# EAGLE design Raspberry Pi Grove Base HAT (EAGLE 6.4)
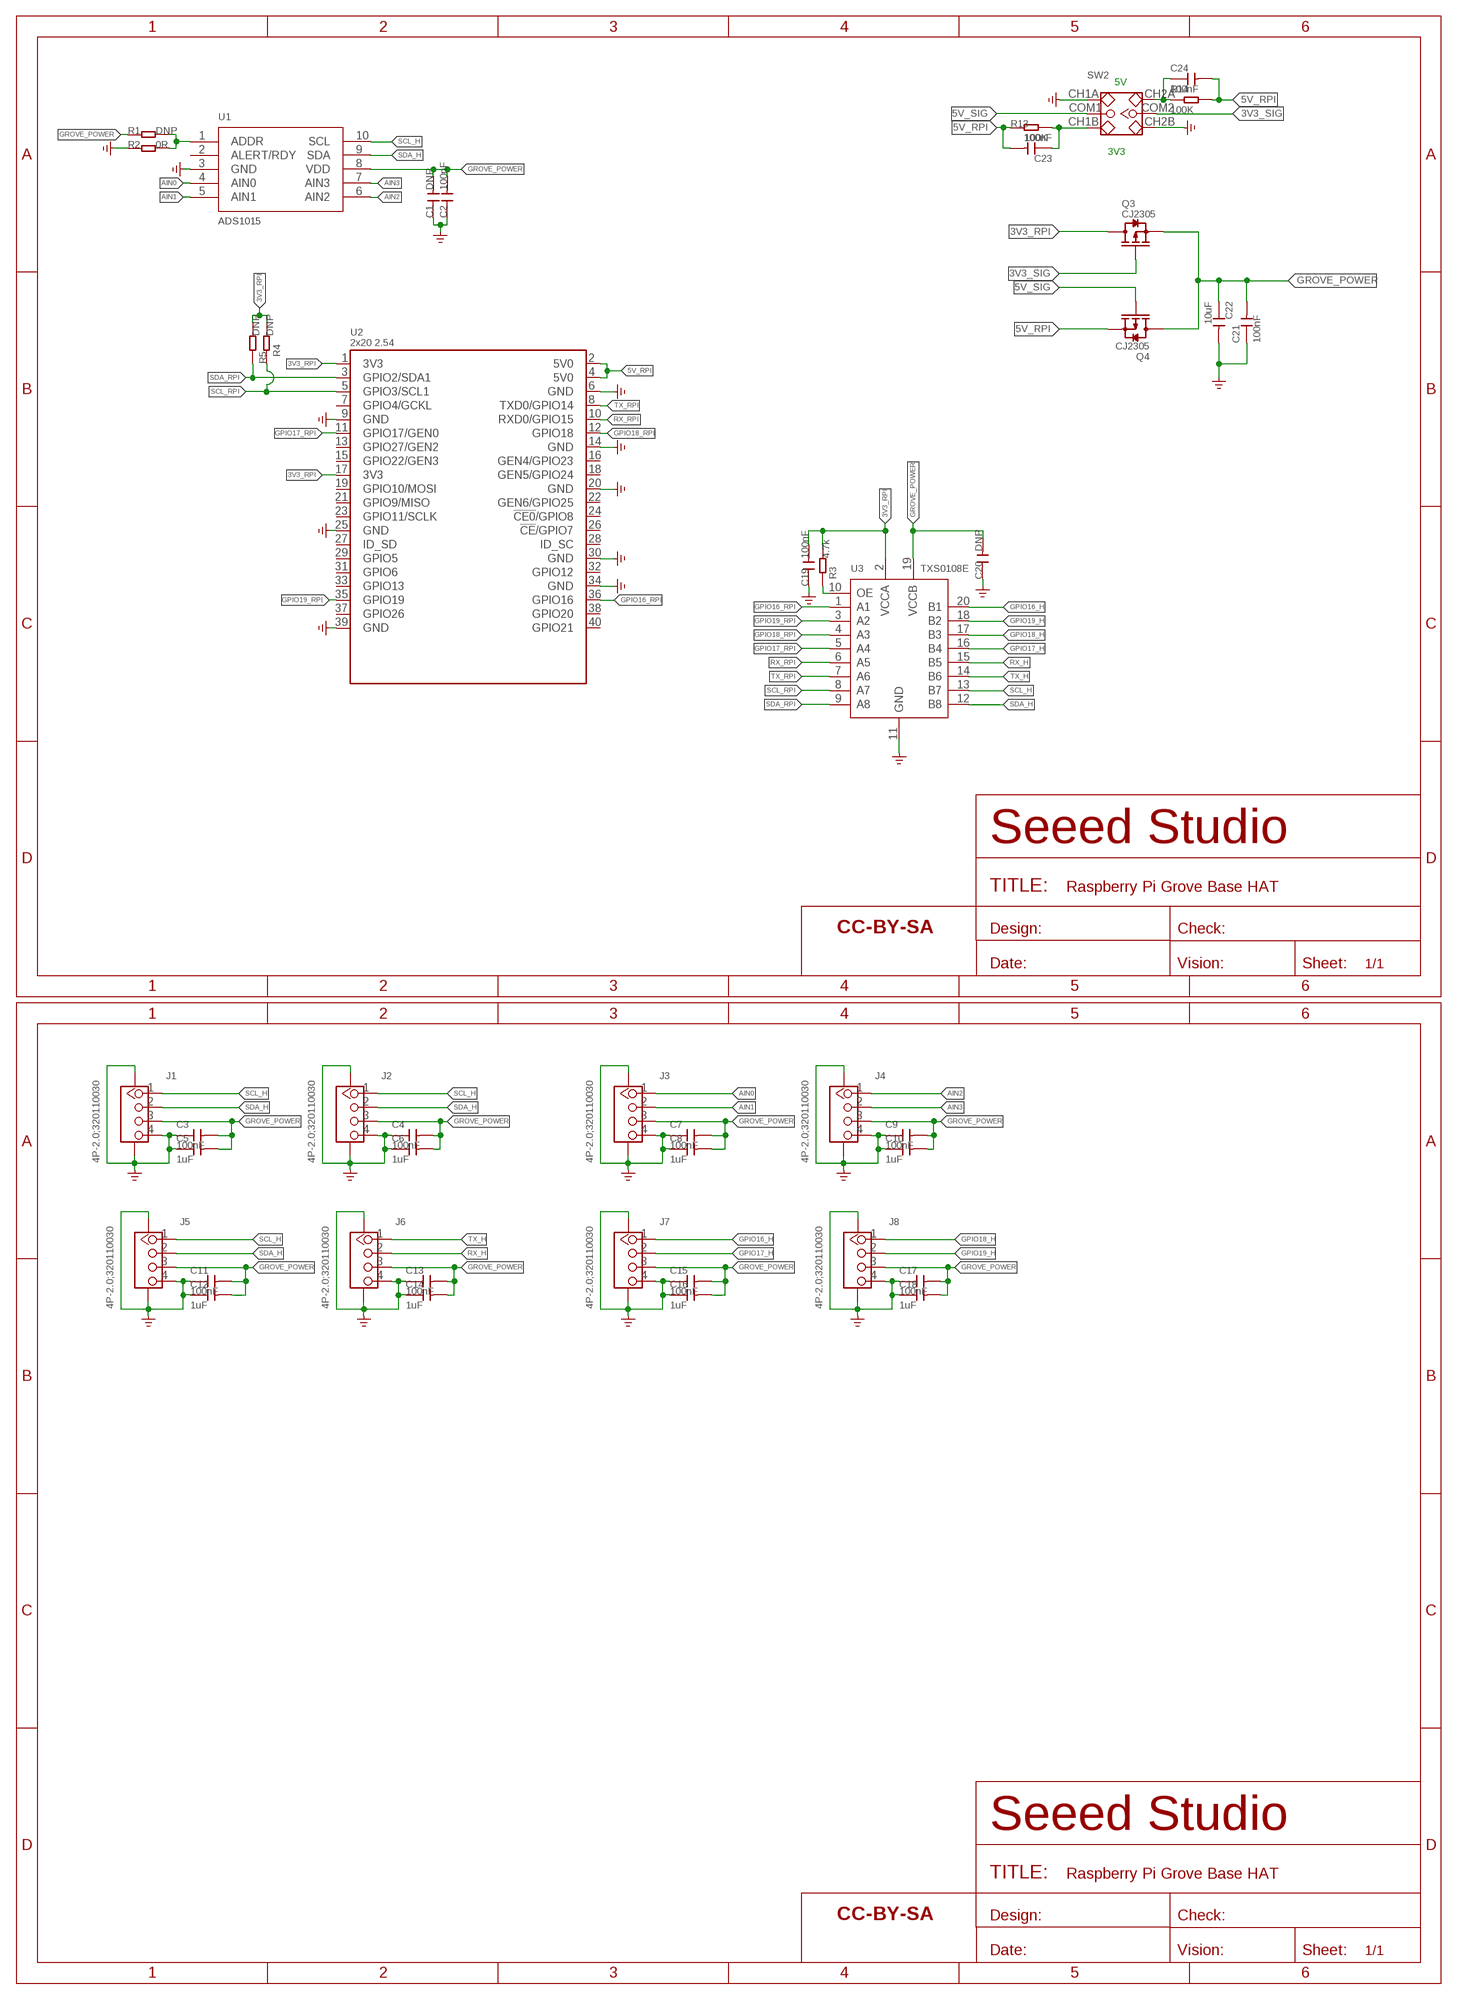
[diagram p0: schematic, sheet 1]

## Parts
C1  DNP  CAP-0603  [C0603]
C2  100nF  CAP-0603  [C0603]
C3  100nF  CAP-0603  [C0603]
C4  100nF  CAP-0603  [C0603]
C5  1uF  CAP-0603  [C0603]
C6  1uF  CAP-0603  [C0603]
C7  100nF  CAP-0603  [C0603]
C8  1uF  CAP-0603  [C0603]
C9  100nF  CAP-0603  [C0603]
C10  1uF  CAP-0603  [C0603]
C11  100nF  CAP-0603  [C0603]
C12  1uF  CAP-0603  [C0603]
C13  100nF  CAP-0603  [C0603]
C14  1uF  CAP-0603  [C0603]
C15  100nF  CAP-0603  [C0603]
C16  1uF  CAP-0603  [C0603]
C17  100nF  CAP-0603  [C0603]
C18  1uF  CAP-0603  [C0603]
C19  100nF  CAP-0603  [C0603]
C20  DNP  CAP-0603  [C0603]
C21  100nF  CAP-0603  [C0603]
C22  10uF  CAP-0603  [C0603]
C23  100nF  CAP-0603  [C0603]
C24  100nF  CAP-0603  [C0603]
FR  SEEEDSTUDIO-OPEN-SCH-FRAME  [SEEEDSTUDIO-PCB-FRAME]
FR1  SEEEDSTUDIO-OPEN-SCH-FRAME  [SEEEDSTUDIO-PCB-FRAME]
J1  4P-2.0;320110030  GROVE-CONNECTOR-SMD'DD'  [HW4-SMD-2.0]
J2  4P-2.0;320110030  GROVE-CONNECTOR-SMD'DD'  [HW4-SMD-2.0]
J3  4P-2.0;320110030  GROVE-CONNECTOR-SMD'DD'  [HW4-SMD-2.0]
J4  4P-2.0;320110030  GROVE-CONNECTOR-SMD'DD'  [HW4-SMD-2.0]
J5  4P-2.0;320110030  GROVE-CONNECTOR-SMD'DD'  [HW4-SMD-2.0]
J6  4P-2.0;320110030  GROVE-CONNECTOR-SMD'DD'  [HW4-SMD-2.0]
J7  4P-2.0;320110030  GROVE-CONNECTOR-SMD'90D'  [HW4-SMD-2.0-90D]
J8  4P-2.0;320110030  GROVE-CONNECTOR-SMD'90D'  [HW4-SMD-2.0-90D]
Q3  CJ2305  MOSFET-P'SI2323CDS/SI2305DS<BR>'  [SOT-23]
Q4  CJ2305  MOSFET-P'SI2323CDS/SI2305DS<BR>'  [SOT-23]
R1  DNP  RES-0603  [R0603]
R2  0R  RES-0603  [R0603]
R3  4.7k  RES-0603  [R0603]
R4  DNP  RES-0603  [R0603]
R5  DNP  RES-0603  [R0603]
R13  100K  RES-0603  [R0603]
R14  100K  RES-0603  [R0603]
SW2  SWITCH-2CH-6P-2.54  SWITCH-2CH-6P-SMD  [6P-SMD-2CH-2.54-3.5X7.2]
U1  ADS1015  CONVERTER-ADS1015IDGST-ADC  [SSOP10-0.5-3X3MM]
U2  2x20 2.54  RPI-ZERO-65X56  [RASPI_BOARD_B+HAT_DF_CF]
U3  TXS0108E  LOGIC-TXS0108EPWR  [TSSOP20-0.65-6.5X4.4MM]

## Nets
3V3_RPI: C19.2 Q3.3(D) R3.2 R4.2 R5.2 U2.1(3V3) U2.17(3V3) U3.2(VCCA)
3V3_SIG: Q3.1(G) SW2.COM2
5V_RPI: C23.2 C24.2 Q4.2(S) R13.1 R14.2 U2.2(5V0) U2.4(5V0)
5V_SIG: Q4.1(G) SW2.COM1
AIN0: J3.1 U1.4(AIN0)
AIN1: J3.2 U1.5(AIN1)
AIN2: J4.1 U1.6(AIN2)
AIN3: J4.2 U1.7(AIN3)
GND: C1.1 C2.1 C3.1 C4.1 C5.1 C6.1 C7.1 C8.1 C9.1 C10.1 C11.1 C12.1 C13.1 C14.1 C15.1 C16.1 C17.1 C18.1 C19.1 C20.1 C21.1 C22.2 J1.4 J1.SS1 J1.SS2 J2.4 J2.SS1 J2.SS2 J3.4 J3.SS1 J3.SS2 J4.4 J4.SS1 J4.SS2 J5.4 J5.SS1 J5.SS2 J6.4 J6.SS1 J6.SS2 J7.4 J7.SS1 J7.SS2 J8.4 J8.SS1 J8.SS2 R2.1 SW2.CH1A SW2.CH2B U1.3(GND) U2.6(GND) U2.9(GND) U2.14(GND) U2.20(GND) U2.25(GND) U2.30(GND) U2.34(GND) U2.39(GND) U3.11(GND) ; supply symbol labelled GND_POWER
GPIO16_H: J7.1 U3.20(B1)
GPIO16_RPI: U2.36(GPIO16) U3.1(A1)
GPIO17_H: J7.2 U3.16(B4)
GPIO17_RPI: U2.11(GPIO17/GEN0) U3.5(A4)
GPIO18_H: J8.1 U3.17(B3)
GPIO18_RPI: U2.12(GPIO18) U3.4(A3)
GPIO19_H: J8.2 U3.18(B2)
GPIO19_RPI: U2.35(GPIO19) U3.3(A2)
GROVE_POWER: C1.2 C2.2 C3.2 C4.2 C5.2 C6.2 C7.2 C8.2 C9.2 C10.2 C11.2 C12.2 C13.2 C14.2 C15.2 C16.2 C17.2 C18.2 C20.2 C21.2 C22.1 J1.3 J2.3 J3.3 J4.3 J5.3 J6.3 J7.3 J8.3 Q3.2(S) Q4.3(D) R1.1 U1.8(VDD) U3.19(VCCB)
N$2: R1.2 R2.2 U1.1(ADDR)
N$5: R3.1 U3.10(OE)
N$11: C23.1 R13.2 SW2.CH1B
N$15: C24.1 R14.1 SW2.CH2A
RX_H: J6.2 U3.15(B5)
RX_RPI: U2.10(RXD0/GPIO15) U3.6(A5)
SCL_H: J1.1 J2.1 J5.1 U1.10(SCL) U3.13(B7)
SCL_RPI: R4.1 U2.5(GPIO3/SCL1) U3.8(A7)
SDA_H: J1.2 J2.2 J5.2 U1.9(SDA) U3.12(B8)
SDA_RPI: R5.1 U2.3(GPIO2/SDA1) U3.9(A8)
TX_H: J6.1 U3.14(B6)
TX_RPI: U2.8(TXD0/GPIO14) U3.7(A6)
Unconnected: U1.2(ALERT/RDY) U2.7(GPIO4/GCKL) U2.13(GPIO27/GEN2) U2.15(GPIO22/GEN3) U2.16(GEN4/GPIO23) U2.18(GEN5/GPIO24) U2.19(GPIO10/MOSI) U2.21(GPIO9/MISO) U2.22(GEN6/GPIO25) U2.23(GPIO11/SCLK) U2.24(!CE0!/GPIO8) U2.26(!CE!/GPIO7) U2.27(ID_SD) U2.28(ID_SC) U2.29(GPIO5) U2.31(GPIO6) U2.32(GPIO12) U2.33(GPIO13) U2.37(GPIO26) U2.38(GPIO20) U2.40(GPIO21)

## Notes on the sheet
- 5V
- 3V3

## Library data of the parts
C1-C24 = Discrete-new:CAP: Ceramic Capacitors
FR FR1 = moudle-new:SEEEDSTUDIO-OPEN-SCH-FRAME
J1-J8 = Connector-new:GROVE-CONNECTOR-SMD: 4P-SMD-2.0:320110030;4P-SMD-2.0-90D:320110032
Q3 Q4 = Discrete-new:MOSFET-P
R1-R5 R13 R14 = Discrete-new:RES
SW2 = Discrete:SWITCH-2CH-6P
U1 = IC-new:CONVERTER-ADS1015IDGST-ADC; MPN: ADS1015IDGST-ADC-兼容1.8V-3.3V
U2 = IC-new:RPI-ZERO
U3 = IC-new:LOGIC-TXS0108EPWR: 310050026

## Net classes
0 default: width 0.025 mm, clearance 0.152 mm

## Board
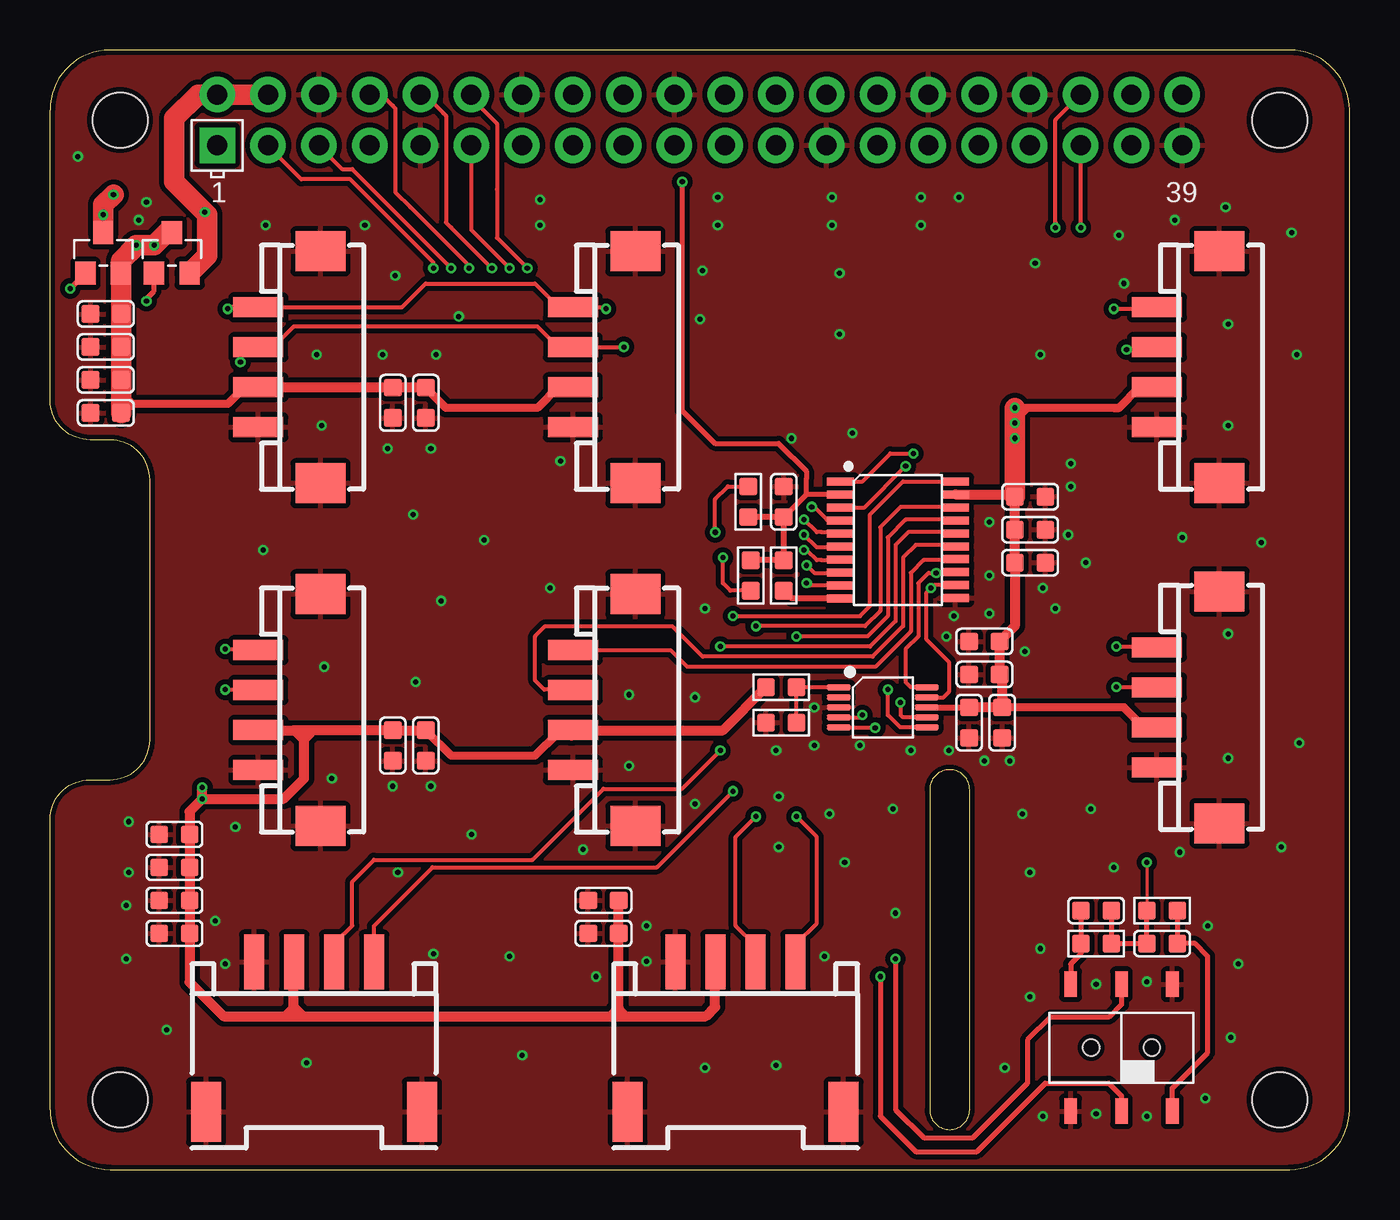
[diagram p1: board, top side]
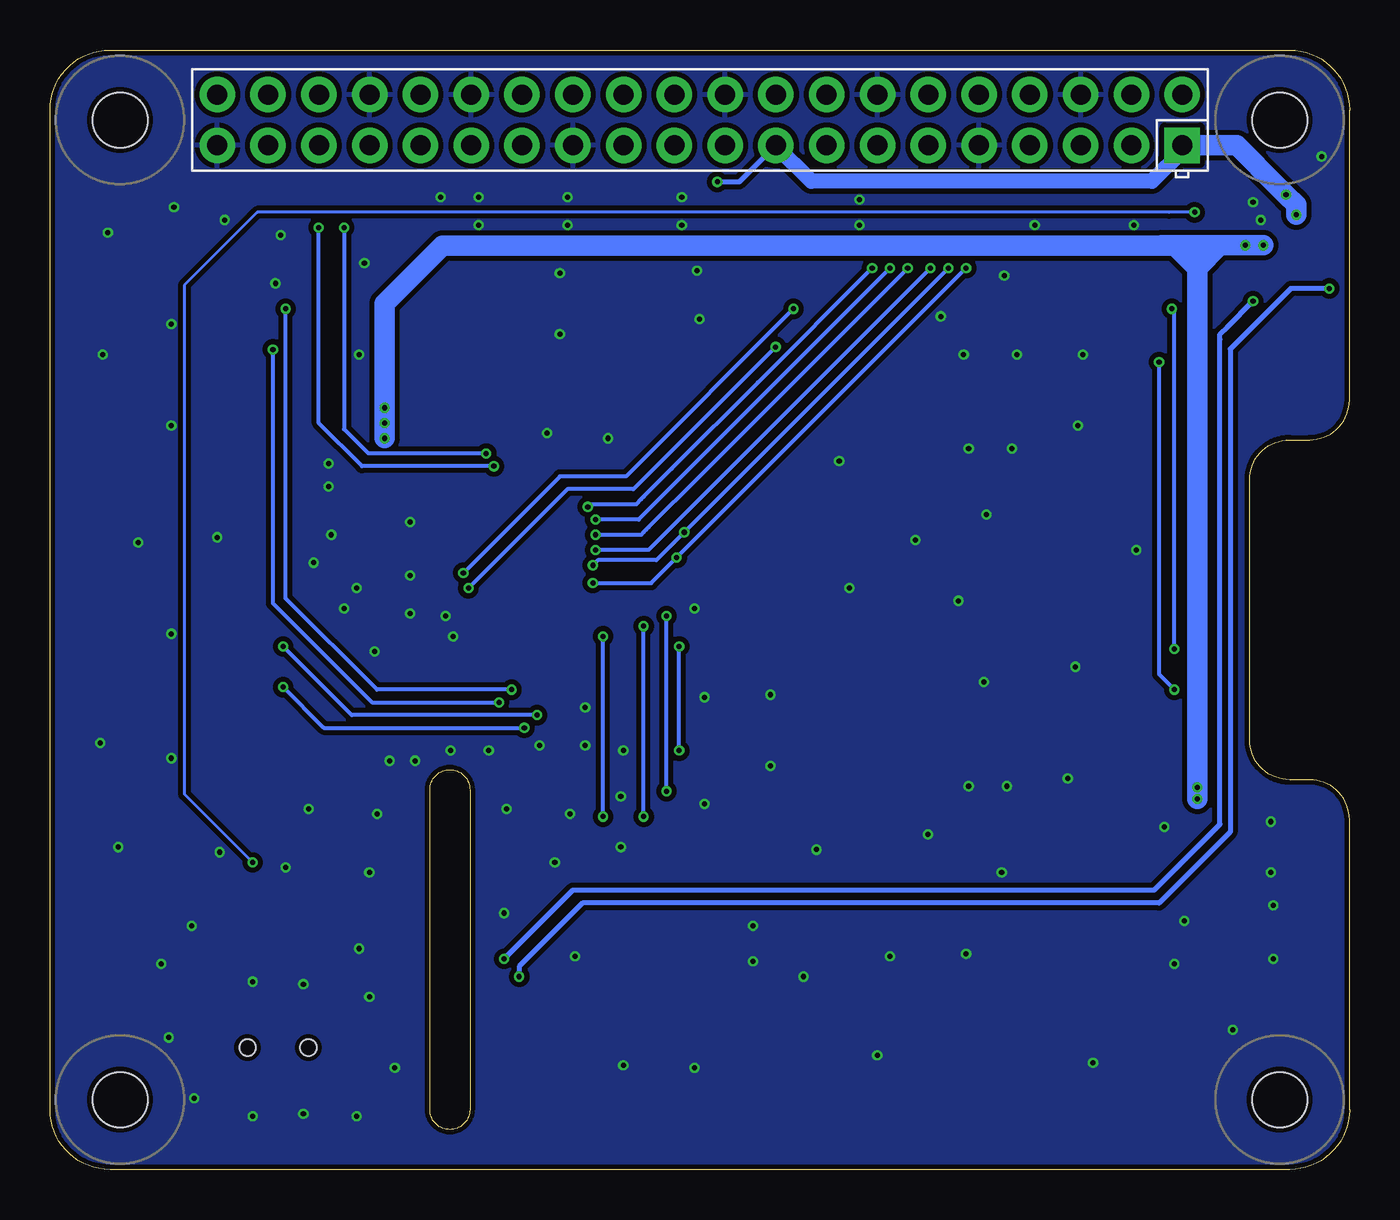
[diagram p2: board, bottom side, seen from below]

Size 65 x 56 mm. Coordinates in mm from the lower left corner, seen from the top.
Copper layers (1*16): Top 0.035mm / dielectric 1.5mm / Bottom 0.035mm
Design rules "SeeedStudio_2layer_DRU_no_angle_20140221 *": minimum track width 1mil, minimum drill 10mil, track to track 6mil, track to pad 6mil, pad to pad 6mil, via to via 6mil, smd to smd 0mil, copper to edge 10mil, drill to drill 10mil, minimum pad ring 4mil, minimum via ring 4mil, stop-mask expansion 2mil, vias tented up to drill 25mil, thermal gap 10mil

### Footprints (pad centres in the part's own frame; a part is rotated, then mirrored left to right if it is on the bottom)
C0603 = smd 0.889 x 0.889: 1 0,0.762; 2 0,-0.762
HW4-SMD-2.0 = smd 1 x 2.5: 1 -3,0; 2 -1,0; 3 1,0; 4 3,0 | smd 2 x 2.5: SS1 -5.8,3.123; SS2 5.8,3.123
HW4-SMD-2.0-90D = smd 1.01 x 2.74: 1 -3,-0.1; 2 -1,-0.1; 3 1,-0.1; 4 3,-0.1 | smd 1.5 x 3: SS1 -5.4,7.4; SS2 5.4,7.4
SOT-23 = smd 1.143 x 1.016: 1 1.016,-0.889; 2 1.016,0.889; 3 -1.016,0
R0603 = smd 0.889 x 0.889: 1 0,0.762; 2 0,-0.762
6P-SMD-2CH-2.54-3.5X7.2 = smd 1.27 x 0.635: CH1A -3.175,2.54; CH1B -3.175,-2.54; CH2A 3.175,2.54; CH2B 3.175,-2.54; COM1 -3.175,0; COM2 3.175,0 | hole 0.813: 0,1.524; 0,-1.524
SSOP10-0.5-3X3MM = smd 0.3 x 1.2: 1 -1,-2.2; 2 -0.5,-2.2; 3 0,-2.2; 4 0.5,-2.2; 5 1,-2.2; 6 1,2.2; 7 0.5,2.2; 8 0,2.2; 9 -0.5,2.2; 10 -1,2.2
RASPI_BOARD_B+HAT_DF_CF = drill 1 pad 1.778 square: 1 8.37,51.23 | drill 1 pad 1.778: 2 8.37,53.77; 3 10.91,51.23; 4 10.91,53.77; 5 13.45,51.23; 6 13.45,53.77; 7 15.99,51.23; 8 15.99,53.77; 9 18.53,51.23; 10 18.53,53.77; 11 21.07,51.23; 12 21.07,53.77; 13 23.61,51.23; 14 23.61,53.77; 15 26.15,51.23; 16 26.15,53.77; 17 28.69,51.23; 18 28.69,53.77; 19 31.23,51.23; 20 31.23,53.77; 21 33.77,51.23; 22 33.77,53.77; 23 36.31,51.23; 24 36.31,53.77; 25 38.85,51.23; 26 38.85,53.77; 27 41.39,51.23; 28 41.39,53.77; 29 43.93,51.23; 30 43.93,53.77; 31 46.47,51.23; 32 46.47,53.77; 33 49.01,51.23; 34 49.01,53.77; 35 51.55,51.23; 36 51.55,53.77; 37 54.09,51.23; 38 54.09,53.77; 39 56.63,51.23; 40 56.63,53.77 | hole 2.75: 3.5,3.5; 3.5,52.5; 61.5,3.5; 61.5,52.5
TSSOP20-0.65-6.5X4.4MM = smd 0.4 x 1.35: 1 -2.925,-2.875; 2 -2.275,-2.875; 3 -1.625,-2.875; 4 -0.975,-2.875; 5 -0.325,-2.875; 6 0.325,-2.875; 7 0.975,-2.875; 8 1.625,-2.875; 9 2.275,-2.875; 10 2.925,-2.875; 11 2.91,2.875; 12 2.26,2.875; 13 1.61,2.875; 14 0.96,2.875; 15 0.325,2.875; 16 -0.325,2.875; 17 -0.975,2.875; 18 -1.625,2.875; 19 -2.275,2.875; 20 -2.925,2.875

### Placement (x,y rotation side)
C1  47.63,22.35 180 top
C2  45.97,22.35 180 top
C3  2.79,37.85 90 top
C4  18.8,38.35 180 top
C5  2.79,39.5 90 top
C6  17.15,38.35 180 top
C7  46.74,24.77 90 top
C8  46.74,26.42 90 top
C9  49.02,32 270 top
C10  49.02,33.66 270 top
C11  6.22,15.11 90 top
C12  6.22,16.76 90 top
C13  18.8,21.21 180 top
C14  17.15,21.21 180 top
C15  6.22,11.81 90 top
C16  6.22,13.46 90 top
C17  27.69,11.81 90 top
C18  27.69,13.46 90 top
C19  36.7,33.4 0 top
C20  49.02,30.35 270 top
C21  2.79,41.15 90 top
C22  2.79,42.8 270 top
C23  52.32,12.95 90 top
C24  55.63,11.3 270 top
FR  -8,-20.57 0 top  (outside the outline)
FR1  -0.51,-57.53 0 top  (outside the outline)
J1  10.41,40.13 270 top
J2  26.16,40.13 270 top
J3  55.37,23.11 270 top
J4  55.37,40.13 270 top
J5  10.41,22.99 270 top
J6  26.16,22.99 270 top
J7  13.21,10.29 180 top
J8  34.29,10.29 180 top
Q3  2.67,45.85 270 top
Q4  6.1,45.85 270 top
R1  36.58,24.13 90 top
R2  36.58,22.35 90 top
R3  36.7,29.72 180 top
R4  34.93,33.4 0 top
R5  35.05,29.72 180 top
R13  52.32,11.3 270 top
R14  55.63,12.95 270 top
SW2  53.59,6.1 270 top
U1  41.66,23.11 270 top
U2  0,0 0 top
U3  42.42,31.5 270 top

### Tracks (layer width: path | path; a pad name or v marks a point on that pad's centre or on a via)
3V3_RPI  (via drill 0.25 pad 0.51)
  Top 0.254: U3.2 37.84,33.77 | 37.84,33.77 C19.2 | 37.84,33.77 37.84,34.54 37.84,34.94 36.45,36.32 33.27,36.32 31.62,37.97 31.62,48.64 v31.62,49.4
  Top 0.305: R5.2 R3.2 C19.2 R4.2
  Top 1.016: v3.18,48.77 2.67,48.26 v2.67,47.75 Q3.3
  Bottom 0.254: U2.17 30.52,49.4 v31.62,49.4
  Bottom 0.762: U2.1 8.37,50.94 9.88,49.43 26.92,49.43 28.7,51.22 U2.17
  Bottom 1.016: U2.1 5.64,51.23 3.56,49.15 v3.18,48.77 2.67,48.26 v2.67,47.75
3V3_SIG  (via drill 0.25 pad 0.51)
  Top 0.254: Q3.1 v1.02,44.07 | v41.53,9.65 41.53,2.67 43.31,0.89 46.36,0.89 49.78,4.32 52.96,4.32 53.59,3.68 SW2.COM2
  Bottom 0.254: v1.02,44.07 2.94,44.07 5.97,41.04 5.97,16.87 5.99,16.87 9.53,13.34 38.35,13.34 41.53,10.16 v41.53,9.65
5V_RPI  (via drill 0.25 pad 0.51)
  Top 0.152: v54.86,15.37 R14.2
  Top 0.254: C23.2 R13.1 C24.2 R14.2
  Top 1.016: U2.4 U2.2 7.42,53.77 6.22,52.58 6.22,49.4 v7.75,47.88 7.87,47.75 7.87,45.72 Q4.2
  Bottom 0.152: v7.75,47.88 9.02,47.88 54.63,47.88 58.28,44.23 58.28,18.78 v54.86,15.37
5V_SIG  (via drill 0.25 pad 0.51)
  Top 0.254: SW2.COM1 53.59,8.26 52.96,7.62 50.04,7.62 48.9,6.48 48.9,4.32 46.17,1.59 43.7,1.59 42.29,3 v42.29,10.54 | v4.83,43.43 4.83,43.56 5.21,43.94 Q4.1
  Bottom 0.254: v42.29,10.54 38.86,13.97 9.78,13.97 6.48,17.27 6.48,41.53 6.48,41.78 6.1,42.16 v4.83,43.43
AIN0  (via drill 0.25 pad 0.51)
  Top 0.203: U1.4 40.52,22.61 v40.64,22.73 | v53.34,26.16 55.32,26.16 J3.1
  Bottom 0.203: v40.64,22.73 49.91,22.73 v53.34,26.16
AIN1  (via drill 0.25 pad 0.51)
  Top 0.203: U1.5 41.26,22.11 v41.28,22.1 | 55.23,24.26 J3.2 55.36,24.13 v53.34,24.13
  Bottom 0.203: v53.34,24.13 51.31,22.1 v41.28,22.1
AIN2  (via drill 0.25 pad 0.51)
  Top 0.203: U1.6 42.53,22.11 41.91,22.73 v41.91,24 | v53.21,43.05 55.29,43.05 J4.1
  Bottom 0.203: v53.21,43.05 53.21,28.57 48.64,24 v41.91,24
AIN3  (via drill 0.25 pad 0.51)
  Top 0.203: U1.7 42.66,22.61 42.55,22.73 v42.55,23.37 | 55.36,41.15 J4.2 55.26,41.02 v53.85,41.02
  Bottom 0.203: v53.85,41.02 53.85,28.32 48.9,23.37 v42.55,23.37
GND  (via drill 0.25 pad 0.51)
  other vias: 12.83,5.33 23.62,5.72 32.77,5.08 36.32,5.21 19.18,10.8 22.99,10.67 44.96,20.95 46.74,20.45 48.01,20.45 44.83,26.67 45.21,27.69 46.99,27.81 46.99,29.72 46.99,32.39 48.77,25.91 50.29,28.07 49.66,29.08 51.82,30.35 50.93,31.75 51.05,34.16 51.05,35.31 49.53,40.77 53.47,46.74 53.72,44.32 49.28,45.34 58.8,48.13 56.26,47.5 62.1,46.86 62.36,40.77 58.93,42.29 58.93,37.21 56.64,31.62 60.58,31.37 58.93,26.8 58.93,20.57 62.48,21.34 53.21,15.11 49.02,14.86 49.53,11.05 56.52,15.88 61.6,16.13 57.91,12.19 54.86,9.4 52.32,9.27 59.44,10.29 59.06,6.6 57.79,3.56 54.86,2.67 52.32,2.79 49.66,2.67 47.75,5.08 49.02,8.64 48.64,17.78 52.07,18.03 38.23,23.11 38.23,21.21 40.51,21.21 43.05,20.95 36.32,20.95 36.45,18.67 36.45,16.13 38.99,17.78 42.16,18.03 39.75,15.37 42.29,12.83 38.74,10.67 29.85,12.19 29.85,10.41 27.31,9.65 8.26,12.45 8.76,10.29 9.27,17.15 17.15,19.18 19.05,19.18 14.1,19.56 21.08,16.76 32.26,18.29 26.67,16 28.96,20.19 32.26,23.62 28.96,23.75 32.77,28.07 25.02,29.08 25.53,35.43 16.89,36.07 37.08,36.58 13.59,37.21 10.67,30.99 18.16,32.77 13.72,25.15 18.29,24.38 21.72,31.5 17.27,44.7 32.51,42.55 39.5,41.78 3.94,17.4 3.94,14.86 3.81,13.21 3.81,10.54 5.84,6.98 19.05,36.07 19.56,28.45 13.34,40.77 19.3,40.77 40.13,36.83 39.5,44.83 32.64,44.96 45.47,48.64 39.12,47.24 43.56,47.24 33.4,47.24 24.51,47.24 10.8,47.24 15.75,47.24 4.83,48.39 1.4,50.67 43.56,48.64 39.12,48.64 33.4,48.64 24.51,48.51 4.45,47.5 17.4,14.86 20.45,42.67 16.64,40.77
  pour Top (isolate 0.254, rank 6): -0.63,56.39 65.41,56.39 65.41,-0.25 -0.63,-0.25
  pour Bottom (isolate 0.254, rank 6): -1.02,56.64 65.66,56.64 65.66,-0.51 -1.02,-0.51
GPIO16_H  (via drill 0.25 pad 0.51)
  Top 0.203: J7.1 16.21,12.19 19.13,15.11 30.35,15.11 v34.16,18.92 | U3.20 42.67,34.42 41.02,32.77 41.02,28.19 40.51,27.69 v34.16,27.69
  Bottom 0.203: v34.16,18.92 v34.16,27.69
GPIO16_RPI  (via drill 0.25 pad 0.51)
  Top 0.203: U2.36 50.29,52.51 50.29,47.37 v50.29,47.12 | U3.1 40.64,34.42 42.04,35.81 v43.18,35.81
  Bottom 0.203: v43.18,35.81 49.07,35.81 50.06,36.81 50.29,37.04 v50.29,47.12
GPIO17_H  (via drill 0.25 pad 0.51)
  Top 0.203: J7.2 14.32,10.39 14.32,11.4 15.11,12.19 15.11,14.4 16.21,15.49 24.13,15.49 27.69,19.05 31.62,19.05 v33.53,20.95 | U3.16 45.24,31.88 42.93,31.88 42.29,31.24 42.29,27.43 41.02,26.16 v33.53,26.16
  Bottom 0.203: v33.53,20.95 v33.53,26.16
GPIO17_RPI  (via drill 0.25 pad 0.51)
  Top 0.203: U2.11 21.07,49.16 21.07,47 v22.99,45.09 | U3.5 39.49,31.88 38.61,31.88 38.35,31.88 v37.72,32.51
  Bottom 0.203: v22.99,45.09 29.08,38.99 33.78,34.29 35.05,33.02 35.31,32.77 35.43,32.64 35.56,32.51 v37.72,32.51
GPIO18_H  (via drill 0.25 pad 0.51)
  Top 0.203: U3.17 45.25,32.51 42.8,32.51 41.91,31.62 41.91,27.69 40.89,26.67 v37.34,26.67 | J8.1 37.34,10.44 37.34,11.3 38.35,12.32 38.35,16.64 v37.34,17.65
  Bottom 0.203: v37.34,17.65 v37.34,26.67
GPIO18_RPI  (via drill 0.25 pad 0.51)
  Top 0.203: U2.12 21.07,53.61 22.35,52.32 22.35,49.02 22.35,46.61 v23.88,45.09 | v38.1,33.15 38.23,33.15 38.86,32.51 39.5,32.51 U3.4
  Bottom 0.203: v23.88,45.09 29.59,39.37 33.91,35.05 35.31,33.66 35.43,33.53 35.69,33.27 37.97,33.27 v38.1,33.15
GPIO19_H  (via drill 0.25 pad 0.51)
  Top 0.203: U3.18 45.27,33.15 42.55,33.15 41.53,32.13 41.53,27.94 40.77,27.18 v35.31,27.18 | J8.2 35.31,10.4 35.31,11.18 34.29,12.19 34.29,16.64 v35.31,17.65
  Bottom 0.203: v35.31,17.65 v35.31,27.18
GPIO19_RPI  (via drill 0.25 pad 0.51)
  Top 0.203: U3.3 40.74,33.12 v42.8,35.18 | v51.56,47.12 51.55,47.13 U2.35
  Bottom 0.203: v42.8,35.18 49.4,35.18 51.56,37.34 v51.56,47.12
GROVE_POWER  (via drill 0.25 pad 0.51)
  Top 0.203: 10.3,39.37 10.3,39.26 10.29,39.24 10.41,39.24 10.54,39.12 | 26.18,21.97 J6.3 26.16,21.72 | 3.56,38.73 3.81,38.73 4.19,38.35 4.19,38.23 3.94,37.97 | 48.26,37.72 48.64,37.72 49.02,38.1
  Top 0.254: U1.8 43.94,23.11 | 26.04,21.72 26.16,21.72 26.8,21.72
  Top 0.305: 43.94,23.11 C2.2
  Top 0.406: 12.19,21.97 12.57,21.59 12.83,21.59 13.08,21.84 | 9.78,38.99 9.59,38.99 8.89,38.29 3.62,38.29 | C13.2 20.07,20.7 24.26,20.7 25.4,21.84 26.02,21.84 J6.3 | 47.75,23.49 47.63,23.62 | J2.3 25.42,39.13 24.38,38.1 19.81,38.1 C4.2 | J3.3 54.72,22.11 53.72,23.11 C1.2 | v48.26,38.1 49.02,38.1 53.2,38.1 53.34,38.1 53.47,38.1 54.5,39.13 J4.3
  Top 0.508: J5.3 10.43,21.97 12.19,21.97 12.7,21.97 | 26.04,21.72 26.15,21.72 | C13.2 C14.2 12.7,21.97 | 11.76,7.66 12.19,8.1 12.19,8.13 | 12.19,8.13 12.19,10.37 J7.3 | 12.66,7.66 28.03,7.66 | 28.03,7.66 28.45,8.09 C17.2 C18.2 | 11.76,7.66 12.66,7.66 | 12.66,7.66 12.19,8.13 | 28.03,7.66 28.79,7.66 | 28.79,7.66 32.81,7.66 33.27,8.13 33.27,10.37 J8.3 | 28.79,7.66 28.45,8 | v7.62,18.54 6.99,17.91 C12.2 C11.2 C16.2 C15.2 6.99,9.37 8.69,7.66 11.76,7.66 | v7.62,18.54 v7.62,19.11 | C10.2 48.26,33.78 | U3.19 48.14,33.77 C10.2 | C10.2 C9.2 C20.2 48.26,27.18 C8.2 C7.2 47.63,24.64 47.63,23.62 C1.2 C2.2 | 11.76,7.66 | C4.2 C6.2 10.54,39.12 9.91,39.12 9.78,38.99 10.27,38.99 J1.3 | 26.18,21.97 33.66,21.97 R1.1 | v7.62,18.54 11.68,18.54 12.7,19.56 12.7,21.97
  Top 1.016: v48.26,38.1 48.26,37.72 v48.26,36.58 C10.2 | Q4.3 5.84,46.86 v5.21,46.23 v4.32,46.23 3.94,45.85 3.56,45.47 Q3.2 C22.1 C21.2 C5.2 3.56,38.73 C3.2 3.56,38.23 3.62,38.29
  Bottom 1.016: v48.26,36.58 v48.26,37.34 v48.26,38.1 48.26,43.31 45.35,46.22 8.75,46.22 8.64,46.1 7.81,45.28 7.62,45.09 | v7.62,18.54 v7.62,19.11 7.62,44.07 7.62,44.96 | 7.62,44.96 7.62,45.09 | v4.32,46.23 v5.21,46.23 6.48,46.23 | 6.48,46.23 6.86,46.23 9.4,46.23 | 7.62,44.96 7.62,45.09 | 7.62,45.09 6.48,46.23
N$2
  Top 0.203: R2.2 R1.2 39.44,24.13 U1.1
N$5
  Top 0.305: U3.10 37.09,28.57 R3.1
N$11
  Top 0.254: C23.1 R13.2 51.56,10.8 51.05,10.29 SW2.CH1B
N$15
  Top 0.254: R14.1 C24.1 57.28,11.3 57.91,10.67 57.91,5.84 56.13,4.06 SW2.CH2A
RX_H
  Top 0.203: U3.15 45.22,31.24 43.31,31.24 42.67,30.61 42.67,27.18 41.15,25.65 32.64,25.65 31.12,27.18 24.77,27.18 24.27,26.69 24.27,24.45 24.72,24 26.16,24 | 26.15,24 J6.2 26.18,24 26.16,24 | 25.04,23.73 25.89,23.73 26.16,24
RX_RPI  (via drill 0.25 pad 0.51)
  Top 0.203: U2.10 18.75,53.77 19.69,52.83 19.81,52.7 19.81,47.37 20.07,47.12 v22.1,45.09 | U3.6 39.49,31.11 38.35,31.11 v37.72,31.75
  Bottom 0.203: v22.1,45.09 32.51,34.67 35.05,32.13 35.18,32 35.31,31.88 35.43,31.75 v37.72,31.75
SCL_H  (via drill 0.25 pad 0.51)
  Top 0.203: 26.04,43.26 J2.1 | v44.32,29.84 43.94,29.84 43.43,29.34 43.43,26.67 42.8,26.04 42.8,24.38 43.07,24.11 U1.10 | v44.32,29.84 45.25,29.84 U3.13 45.38,29.97 45.85,29.97 45.72,29.84 v44.32,29.84 | v8.76,26.04 10.37,26.04 J5.1 | J2.1 27.73,43.13 v27.81,43.05 | v8.89,43.05 8.97,43.13 J1.1 17.61,43.13 18.8,44.32 24.26,44.32 25.27,43.31 25.99,43.31 J2.1
  Bottom 0.203: v27.81,43.05 36.2,34.67 39.5,34.67 v44.32,29.84 | v8.76,26.04 8.76,42.93 v8.89,43.05
SCL_RPI  (via drill 0.25 pad 0.51)
  Top 0.203: v20.07,45.09 18.48,46.67 16.64,48.51 15.11,50.04 14.61,50.04 13.45,51.19 U2.5 | U3.8 39.52,29.84 38.23,29.84 v37.85,30.23 | v33.27,31.88 33.27,33.53 33.91,34.16 R4.1
  Bottom 0.203: v20.07,45.09 v33.27,31.88 34.67,30.48 37.59,30.48 v37.85,30.23
SDA_H  (via drill 0.25 pad 0.51)
  Top 0.203: J5.2 8.78,23.99 v8.76,24 | v9.53,40.39 9.53,41.02 9.65,41.15 10.4,41.15 J1.2 10.65,40.89 10.92,40.89 12.19,42.16 24.38,42.16 25.42,41.13 J2.2 28.69,41.13 v28.7,41.15 | U3.12 44.22,29.24 v44.07,29.08 43.82,28.83 43.82,26.54 44.96,25.4 44.96,23.88 44.7,23.61 U1.9
  Bottom 0.203: v8.76,24 9.53,24.77 v9.53,40.39 | v28.7,41.15 35.81,34.04 39.12,34.04 v44.07,29.08
SDA_RPI  (via drill 0.25 pad 0.51)
  Top 0.203: v19.18,45.09 19.18,45.21 19.18,45.37 15.02,49.53 12.57,49.53 10.91,51.19 U2.3 | U3.9 39.53,29.21 37.97,29.21 v37.85,29.34 | R5.1 34.04,28.96 33.66,29.34 v33.66,30.61
  Bottom 0.203: v19.18,45.09 v33.66,30.61 34.93,29.34 v37.85,29.34
TX_H
  Top 0.203: U3.14 45.24,30.48 43.69,30.48 43.05,29.84 43.05,26.92 41.28,25.15 31.88,25.15 31.56,25.46 31.12,25.91 31.04,25.99 J6.1 26.46,26.29
TX_RPI  (via drill 0.25 pad 0.51)
  Top 0.203: U2.8 16.59,53.77 17.15,53.21 17.27,53.09 17.27,48.9 18.03,48.13 20.96,45.21 v20.96,45.09 | U3.7 39.5,30.48 38.61,30.48 38.35,30.48 37.85,30.99 v37.72,30.99
  Bottom 0.203: v37.72,30.99 37.59,30.99 37.47,30.99 35.05,30.99 22.35,43.69 22.23,43.81 v20.96,45.09